# EAGLE schematic spi_barometer (EAGLE 7.2.0)
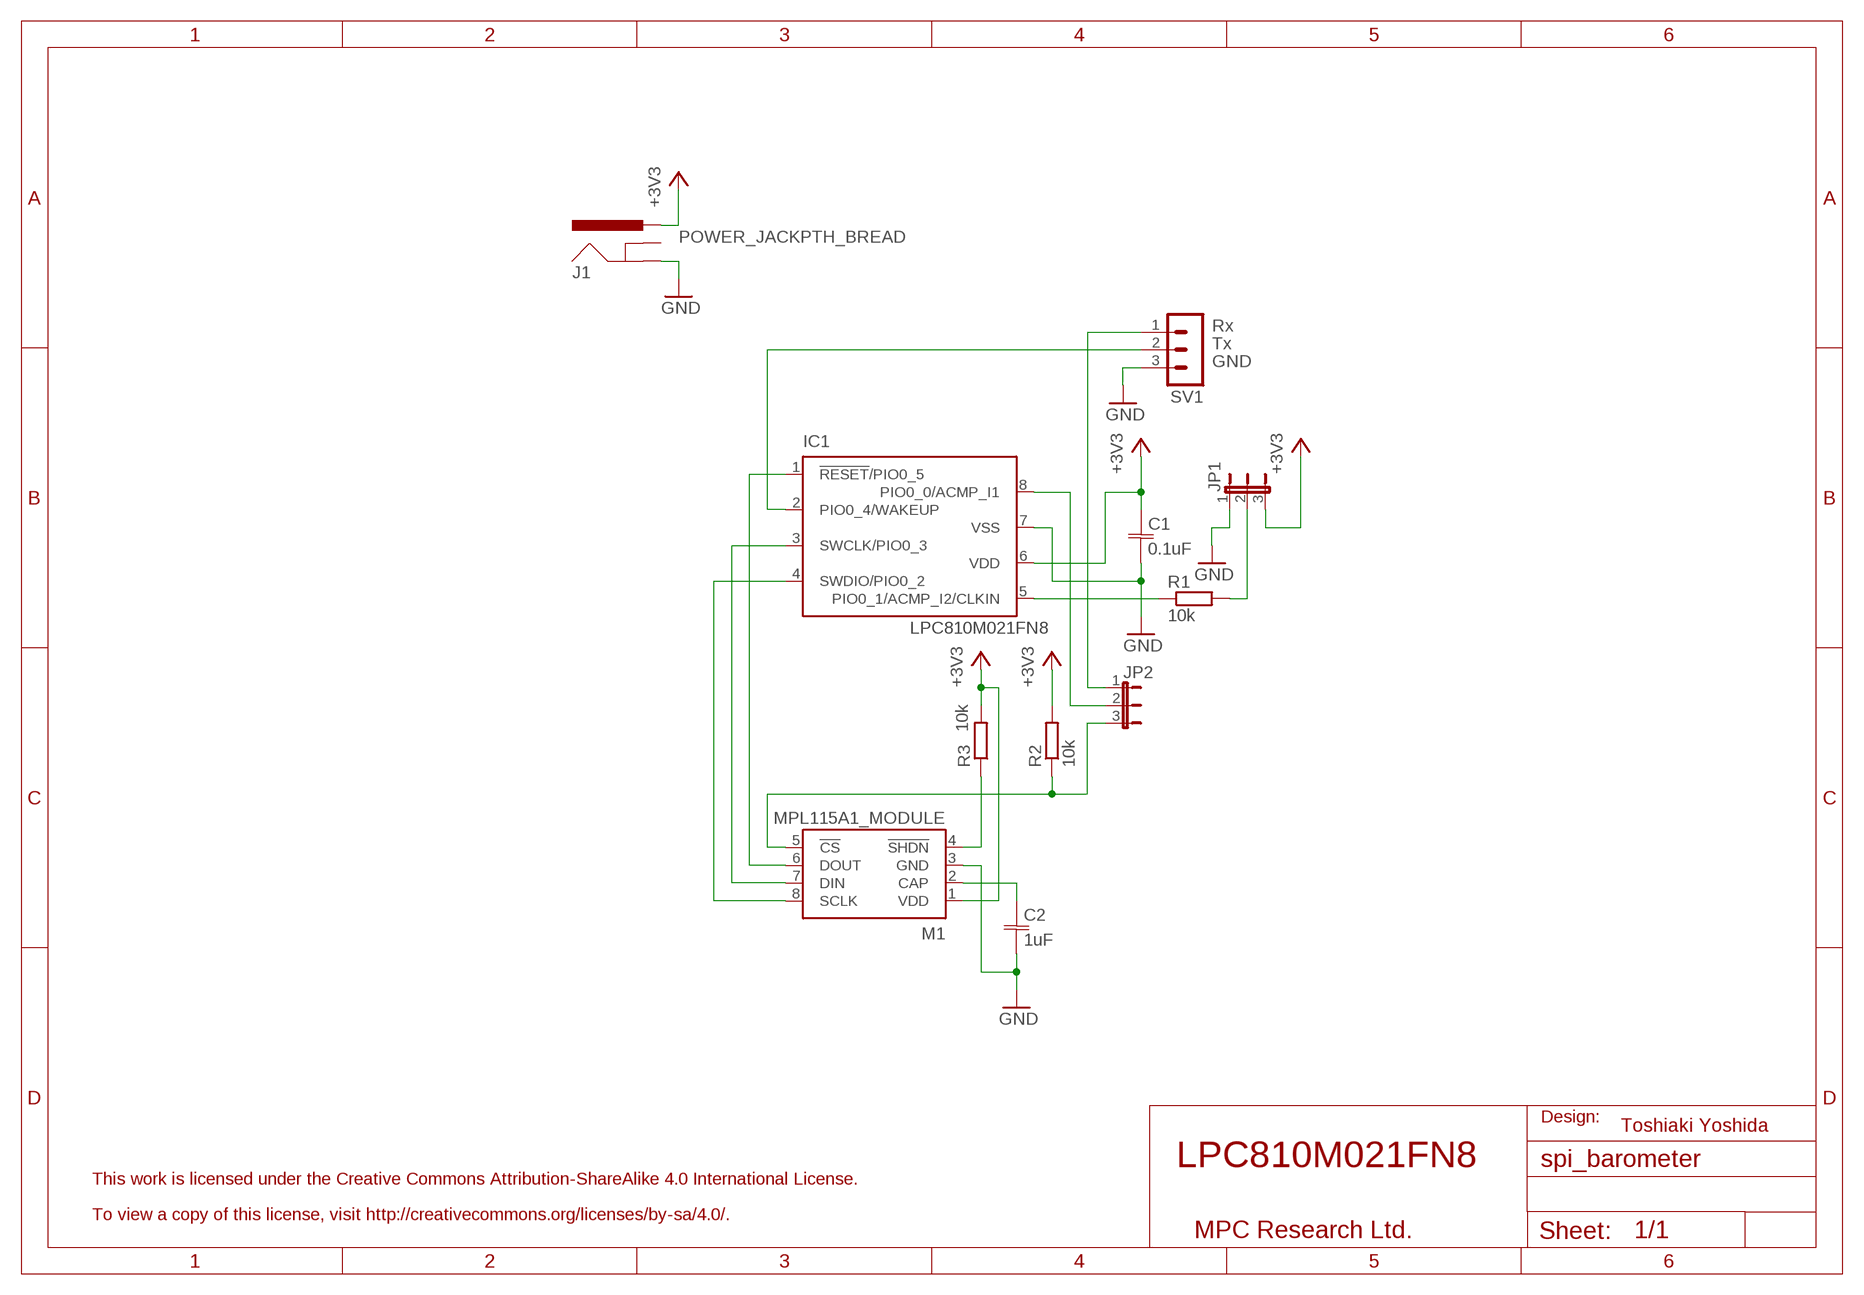
[diagram p0: schematic, sheet 1]

## Parts
C1  0.1uF  C-JIS050-024X044  [C050-024X044]
C2  1uF  C-JIS050-024X044  [C050-024X044]
IC1  LPC810M021FN8  [DIL08]
J1  POWER_JACKPTH_BREAD  [POWER_JACK_PTH_BREAD]
JP1  JP2E  [JP2]
JP2  JP2E  [JP2]
M1  MPL115A1_MODULE  [DIL8]
R1  10k  R-EU_0207/10  [0207/10]
R2  10k  R-EU_0207/10  [0207/10]
R3  10k  R-EU_0207/10  [0207/10]
SV1  MA03-1  [MA03-1]

## Nets
+3V3: C1.1 IC1.6(VDD) J1.PWR JP1.3 M1.1(VDD) R2.2 R3.2
GND: C1.2 C2.2 IC1.7(VSS) J1.GND JP1.1 M1.3(GND) SV1.3
N$1: IC1.1(!RESET!/PIO0_5) M1.6(DOUT)
N$2: IC1.4(SWDIO/PIO0_2) M1.8(SCLK)
N$3: IC1.5(PIO0_1/ACMP_I2/CLKIN) R1.1
N$4: JP1.2 R1.2
N$5: JP2.1 SV1.1
N$6: IC1.2(PIO0_4/WAKEUP) SV1.2
N$7: IC1.3(SWCLK/PIO0_3) M1.7(DIN)
N$8: M1.4(!SHDN) R3.1
N$9: C2.1 M1.2(CAP)
N$10: IC1.8(PIO0_0/ACMP_I1) JP2.2
N$11: JP2.3 M1.5(!CS) R2.1
Unconnected: J1.GNDBREAK

## Notes on the sheet
- Rx
- Tx
- GND
- Design:
- Toshiaki Yoshida
- LPC810M021FN8
- This work is licensed under the Creative Commons Attribution-ShareAlike 4.0 International License.
- To view a copy of this license, visit http://creativecommons.org/licenses/by-sa/4.0/.
- MPC Research Ltd.

## Library data of the parts
C1 C2 = cap:C-JIS: CAPACITOR, Japanese symbol
IC1 = nxp:LPC810M021
J1 = SparkFun-Connectors:POWER_JACK: Power Jack This is the standard 5.5mm barrel jack for power. The PTH is the most common, proven, reliable, footprint. The Slot footprint only works if the mill layer is transmitted to the PCB fab house so be warned. Mating wall wart : TOL-00298 (and others); PROD_ID: PRT-10811
JP1 JP2 = jumper:JP2E: JUMPER
M1 = akizuki:MPL115A1_MODULE
R1-R3 = resistor:R-EU_: RESISTOR, European symbol
SV1 = con-lstb:MA03-1: PIN HEADER; OC_FARNELL: unknown; OC_NEWARK: unknown